# EAGLE design Keyboard V3.4 (EAGLE 9.3.1)
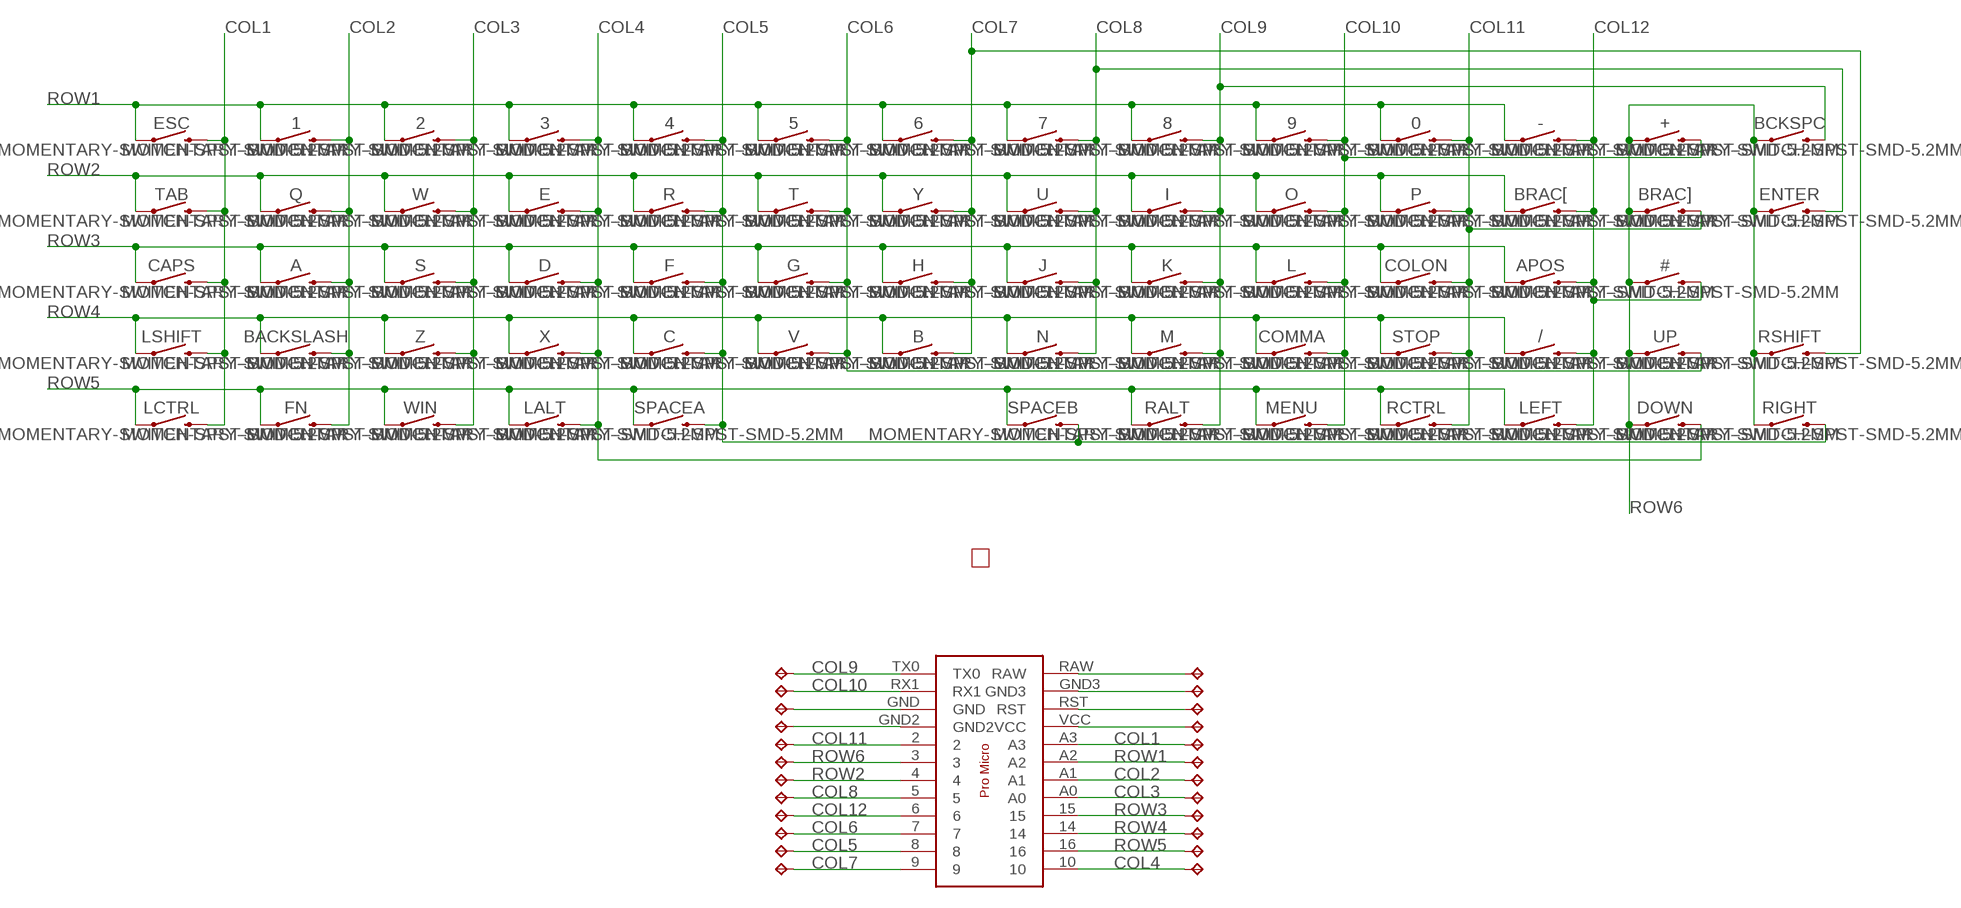
[diagram p0: schematic, sheet 1]

## Parts
0  MOMENTARY-SWITCH-SPST-SMD-5.2MM  [TACTILE_SWITCH_SMD_5.2MM]
1  MOMENTARY-SWITCH-SPST-SMD-5.2MM  [TACTILE_SWITCH_SMD_5.2MM]
2  MOMENTARY-SWITCH-SPST-SMD-5.2MM  [TACTILE_SWITCH_SMD_5.2MM]
3  MOMENTARY-SWITCH-SPST-SMD-5.2MM  [TACTILE_SWITCH_SMD_5.2MM]
4  MOMENTARY-SWITCH-SPST-SMD-5.2MM  [TACTILE_SWITCH_SMD_5.2MM]
5  MOMENTARY-SWITCH-SPST-SMD-5.2MM  [TACTILE_SWITCH_SMD_5.2MM]
6  MOMENTARY-SWITCH-SPST-SMD-5.2MM  [TACTILE_SWITCH_SMD_5.2MM]
7  MOMENTARY-SWITCH-SPST-SMD-5.2MM  [TACTILE_SWITCH_SMD_5.2MM]
8  MOMENTARY-SWITCH-SPST-SMD-5.2MM  [TACTILE_SWITCH_SMD_5.2MM]
9  MOMENTARY-SWITCH-SPST-SMD-5.2MM  [TACTILE_SWITCH_SMD_5.2MM]
#  MOMENTARY-SWITCH-SPST-SMD-5.2MM  [TACTILE_SWITCH_SMD_5.2MM]
+  MOMENTARY-SWITCH-SPST-SMD-5.2MM  [TACTILE_SWITCH_SMD_5.2MM]
-  MOMENTARY-SWITCH-SPST-SMD-5.2MM  [TACTILE_SWITCH_SMD_5.2MM]
/  MOMENTARY-SWITCH-SPST-SMD-5.2MM  [TACTILE_SWITCH_SMD_5.2MM]
A  MOMENTARY-SWITCH-SPST-SMD-5.2MM  [TACTILE_SWITCH_SMD_5.2MM]
APOS  MOMENTARY-SWITCH-SPST-SMD-5.2MM  [TACTILE_SWITCH_SMD_5.2MM]
B  MOMENTARY-SWITCH-SPST-SMD-5.2MM  [TACTILE_SWITCH_SMD_5.2MM]
BACKSLASH  MOMENTARY-SWITCH-SPST-SMD-5.2MM  [TACTILE_SWITCH_SMD_5.2MM]
BCKSPC  MOMENTARY-SWITCH-SPST-SMD-5.2MM  [TACTILE_SWITCH_SMD_5.2MM]
BRAC[  MOMENTARY-SWITCH-SPST-SMD-5.2MM  [TACTILE_SWITCH_SMD_5.2MM]
BRAC]  MOMENTARY-SWITCH-SPST-SMD-5.2MM  [TACTILE_SWITCH_SMD_5.2MM]
C  MOMENTARY-SWITCH-SPST-SMD-5.2MM  [TACTILE_SWITCH_SMD_5.2MM]
CAPS  MOMENTARY-SWITCH-SPST-SMD-5.2MM  [TACTILE_SWITCH_SMD_5.2MM]
COLON  MOMENTARY-SWITCH-SPST-SMD-5.2MM  [TACTILE_SWITCH_SMD_5.2MM]
COMMA  MOMENTARY-SWITCH-SPST-SMD-5.2MM  [TACTILE_SWITCH_SMD_5.2MM]
D  MOMENTARY-SWITCH-SPST-SMD-5.2MM  [TACTILE_SWITCH_SMD_5.2MM]
DOWN  MOMENTARY-SWITCH-SPST-SMD-5.2MM  [TACTILE_SWITCH_SMD_5.2MM]
E  MOMENTARY-SWITCH-SPST-SMD-5.2MM  [TACTILE_SWITCH_SMD_5.2MM]
ENTER  MOMENTARY-SWITCH-SPST-SMD-5.2MM  [TACTILE_SWITCH_SMD_5.2MM]
ESC  MOMENTARY-SWITCH-SPST-SMD-5.2MM  [TACTILE_SWITCH_SMD_5.2MM]
F  MOMENTARY-SWITCH-SPST-SMD-5.2MM  [TACTILE_SWITCH_SMD_5.2MM]
FN  MOMENTARY-SWITCH-SPST-SMD-5.2MM  [TACTILE_SWITCH_SMD_5.2MM]
G  MOMENTARY-SWITCH-SPST-SMD-5.2MM  [TACTILE_SWITCH_SMD_5.2MM]
H  MOMENTARY-SWITCH-SPST-SMD-5.2MM  [TACTILE_SWITCH_SMD_5.2MM]
I  MOMENTARY-SWITCH-SPST-SMD-5.2MM  [TACTILE_SWITCH_SMD_5.2MM]
J  MOMENTARY-SWITCH-SPST-SMD-5.2MM  [TACTILE_SWITCH_SMD_5.2MM]
K  MOMENTARY-SWITCH-SPST-SMD-5.2MM  [TACTILE_SWITCH_SMD_5.2MM]
L  MOMENTARY-SWITCH-SPST-SMD-5.2MM  [TACTILE_SWITCH_SMD_5.2MM]
LALT  MOMENTARY-SWITCH-SPST-SMD-5.2MM  [TACTILE_SWITCH_SMD_5.2MM]
LCTRL  MOMENTARY-SWITCH-SPST-SMD-5.2MM  [TACTILE_SWITCH_SMD_5.2MM]
LEFT  MOMENTARY-SWITCH-SPST-SMD-5.2MM  [TACTILE_SWITCH_SMD_5.2MM]
LSHIFT  MOMENTARY-SWITCH-SPST-SMD-5.2MM  [TACTILE_SWITCH_SMD_5.2MM]
M  MOMENTARY-SWITCH-SPST-SMD-5.2MM  [TACTILE_SWITCH_SMD_5.2MM]
MENU  MOMENTARY-SWITCH-SPST-SMD-5.2MM  [TACTILE_SWITCH_SMD_5.2MM]
N  MOMENTARY-SWITCH-SPST-SMD-5.2MM  [TACTILE_SWITCH_SMD_5.2MM]
O  MOMENTARY-SWITCH-SPST-SMD-5.2MM  [TACTILE_SWITCH_SMD_5.2MM]
P  MOMENTARY-SWITCH-SPST-SMD-5.2MM  [TACTILE_SWITCH_SMD_5.2MM]
Q  MOMENTARY-SWITCH-SPST-SMD-5.2MM  [TACTILE_SWITCH_SMD_5.2MM]
R  MOMENTARY-SWITCH-SPST-SMD-5.2MM  [TACTILE_SWITCH_SMD_5.2MM]
RALT  MOMENTARY-SWITCH-SPST-SMD-5.2MM  [TACTILE_SWITCH_SMD_5.2MM]
RCTRL  MOMENTARY-SWITCH-SPST-SMD-5.2MM  [TACTILE_SWITCH_SMD_5.2MM]
RIGHT  MOMENTARY-SWITCH-SPST-SMD-5.2MM  [TACTILE_SWITCH_SMD_5.2MM]
RSHIFT  MOMENTARY-SWITCH-SPST-SMD-5.2MM  [TACTILE_SWITCH_SMD_5.2MM]
S  MOMENTARY-SWITCH-SPST-SMD-5.2MM  [TACTILE_SWITCH_SMD_5.2MM]
SPACEA  MOMENTARY-SWITCH-SPST-SMD-5.2MM  [TACTILE_SWITCH_SMD_5.2MM]
SPACEB  MOMENTARY-SWITCH-SPST-SMD-5.2MM  [TACTILE_SWITCH_SMD_5.2MM]
STOP  MOMENTARY-SWITCH-SPST-SMD-5.2MM  [TACTILE_SWITCH_SMD_5.2MM]
T  MOMENTARY-SWITCH-SPST-SMD-5.2MM  [TACTILE_SWITCH_SMD_5.2MM]
TAB  MOMENTARY-SWITCH-SPST-SMD-5.2MM  [TACTILE_SWITCH_SMD_5.2MM]
TP1  TPTP14R  [TP14R]
TP2  TPTP14R  [TP14R]
TP3  TPTP14R  [TP14R]
TP4  TPTP14R  [TP14R]
TP5  TPTP14R  [TP14R]
TP6  TPTP14R  [TP14R]
TP7  TPTP14R  [TP14R]
TP8  TPTP14R  [TP14R]
TP9  TPTP14R  [TP14R]
TP10  TPTP14R  [TP14R]
TP11  TPTP14R  [TP14R]
TP12  TPTP14R  [TP14R]
TP13  TPTP14R  [TP14R]
TP14  TPTP14R  [TP14R]
TP15  TPTP14R  [TP14R]
TP16  TPTP14R  [TP14R]
TP17  TPTP14R  [TP14R]
TP18  TPTP14R  [TP14R]
TP19  TPTP14R  [TP14R]
TP20  TPTP14R  [TP14R]
TP21  TPTP14R  [TP14R]
TP22  TPTP14R  [TP14R]
TP23  TPTP14R  [TP14R]
TP24  TPTP14R  [TP14R]
U  MOMENTARY-SWITCH-SPST-SMD-5.2MM  [TACTILE_SWITCH_SMD_5.2MM]
U$1  PEANUT-PRO-MICRO  [PRO-MICRO]
U$3  AMP-HALF  [AMP-HALF]
UP  MOMENTARY-SWITCH-SPST-SMD-5.2MM  [TACTILE_SWITCH_SMD_5.2MM]
V  MOMENTARY-SWITCH-SPST-SMD-5.2MM  [TACTILE_SWITCH_SMD_5.2MM]
W  MOMENTARY-SWITCH-SPST-SMD-5.2MM  [TACTILE_SWITCH_SMD_5.2MM]
WIN  MOMENTARY-SWITCH-SPST-SMD-5.2MM  [TACTILE_SWITCH_SMD_5.2MM]
X  MOMENTARY-SWITCH-SPST-SMD-5.2MM  [TACTILE_SWITCH_SMD_5.2MM]
Y  MOMENTARY-SWITCH-SPST-SMD-5.2MM  [TACTILE_SWITCH_SMD_5.2MM]
Z  MOMENTARY-SWITCH-SPST-SMD-5.2MM  [TACTILE_SWITCH_SMD_5.2MM]

## Nets
COL1: CAPS.3 CAPS.4 ESC.3 ESC.4 LCTRL.3 LCTRL.4 LSHIFT.3 LSHIFT.4 TAB.3 TAB.4 TP8.TP U$1.A3
COL2: 1.3 1.4 A.3 A.4 BACKSLASH.3 BACKSLASH.4 FN.3 FN.4 Q.3 Q.4 TP6.TP U$1.A1
COL3: 2.3 2.4 S.3 S.4 TP5.TP U$1.A0 W.3 W.4 WIN.3 WIN.4 Z.3 Z.4
COL4: 3.3 3.4 D.3 D.4 DOWN.3 DOWN.4 E.3 E.4 LALT.3 LALT.4 TP2.TP U$1.10 X.3 X.4
COL5: 4.3 4.4 C.3 C.4 F.3 F.4 R.3 R.4 RIGHT.3 RIGHT.4 SPACEA.3 SPACEA.4 SPACEB.3 SPACEB.4 TP17.TP U$1.8
COL6: 5.3 5.4 G.3 G.4 T.3 T.4 TP16.TP U$1.7 UP.3 UP.4 V.3 V.4
COL7: 6.3 6.4 B.3 B.4 H.3 H.4 RSHIFT.3 RSHIFT.4 TP18.TP U$1.9 Y.3 Y.4
COL8: 7.3 7.4 ENTER.3 ENTER.4 J.3 J.4 N.3 N.4 TP14.TP U$1.5 U.3 U.4
COL9: 8.3 8.4 BCKSPC.3 BCKSPC.4 I.3 I.4 K.3 K.4 M.3 M.4 RALT.3 RALT.4 TP9.TP U$1.TX0
COL10: 9.3 9.4 +.3 +.4 COMMA.3 COMMA.4 L.3 L.4 MENU.3 MENU.4 O.3 O.4 TP10.TP U$1.RX1
COL11: 0.3 0.4 BRAC].3 BRAC].4 COLON.3 COLON.4 P.3 P.4 RCTRL.3 RCTRL.4 STOP.3 STOP.4 TP11.TP U$1.2
COL12: #.3 #.4 -.3 -.4 /.3 /.4 APOS.3 APOS.4 BRAC[.3 BRAC[.4 LEFT.3 LEFT.4 TP15.TP U$1.6
N$1: TP20.TP U$1.GND
N$2: TP19.TP U$1.GND2
N$3: TP24.TP U$1.RAW
N$4: TP23.TP U$1.GND3
N$5: TP22.TP U$1.RST
N$6: TP21.TP U$1.VCC
ROW1: 0.1 0.2 1.1 1.2 2.1 2.2 3.1 3.2 4.1 4.2 5.1 5.2 6.1 6.2 7.1 7.2 8.1 8.2 9.1 9.2 -.1 -.2 ESC.1 ESC.2 TP7.TP U$1.A2
ROW2: BRAC[.1 BRAC[.2 E.1 E.2 I.1 I.2 O.1 O.2 P.1 P.2 Q.1 Q.2 R.1 R.2 T.1 T.2 TAB.1 TAB.2 TP13.TP U$1.4 U.1 U.2 W.1 W.2 Y.1 Y.2
ROW3: A.1 A.2 APOS.1 APOS.2 CAPS.1 CAPS.2 COLON.1 COLON.2 D.1 D.2 F.1 F.2 G.1 G.2 H.1 H.2 J.1 J.2 K.1 K.2 L.1 L.2 S.1 S.2 TP4.TP U$1.15
ROW4: /.1 /.2 B.1 B.2 BACKSLASH.1 BACKSLASH.2 C.1 C.2 COMMA.1 COMMA.2 LSHIFT.1 LSHIFT.2 M.1 M.2 N.1 N.2 STOP.1 STOP.2 TP3.TP U$1.14 V.1 V.2 X.1 X.2 Z.1 Z.2
ROW5: FN.1 FN.2 LALT.1 LALT.2 LCTRL.1 LCTRL.2 LEFT.1 LEFT.2 MENU.1 MENU.2 RALT.1 RALT.2 RCTRL.1 RCTRL.2 SPACEA.1 SPACEA.2 SPACEB.1 SPACEB.2 TP1.TP U$1.16 WIN.1 WIN.2
ROW6: #.1 #.2 +.1 +.2 BCKSPC.1 BCKSPC.2 BRAC].1 BRAC].2 DOWN.1 DOWN.2 ENTER.1 ENTER.2 RIGHT.1 RIGHT.2 RSHIFT.1 RSHIFT.2 TP12.TP U$1.3 UP.1 UP.2

## Library data of the parts
0 1-9 # + - / A APOS B BACKSLASH BCKSPC BRAC[ BRAC] C CAPS COLON COMMA D DOWN E ENTER ESC F FN G H I J K L LALT LCTRL LEFT LSHIFT M MENU N O P Q R RALT RCTRL RIGHT RSHIFT S SPACEA SPACEB STOP T TAB U UP V W WIN X Y Z = SparkFun-Switches-Edit:MOMENTARY-SWITCH-SPST: Momentary Switch (Pushbutton) - SPST Normally-open (NO) SPST momentary switches (buttons, pushbuttons). Variants PTH-12MM - 12mm square, through-hole Momentary Pushbutton Switch - 12mm Square <https://www.sparkfun.com/products/9190> (COM-09190) PTH-6.0MM, PTH-6.0MM-KIT - 6.0mm square, through-hole Mini Pushbutton Switch <https://www.sparkfun.com/products/97> (COM-00097) KIT package intended for soldering kit's - only one side of pads' copper is exposed. PTH-RIGHT-ANGLE-KIT - Right-angle, through-hole Right Angle Tactile Button <https://www.sparkfun.com/products/10791> - Used on SparkFun BigTime Watch Kit <https://www.sparkfun.com/products/11734> SMD-12MM - 12mm square, surface-mount Tactile Button - SMD (12mm) <https://www.sparkfun.com/products/12993> (COM-12993) Used on SparkFun PicoBoard <https://www.sparkfun.com/products/11888> SMD-4.5MM - 4.5mm Square Trackball Switch Used on SparkFun Blackberry Trackballer Breakout <https://www.sparkfun.com/products/13169> SMD-4.6MMX2.8MM - 4.60mm x 2.80mm, surface mount Used on SparkFun SAMD21 Mini Breakout <https://www.sparkfun.com/products/13664> SMD-5.2MM, SMD-5.2-REDUNDANT - 5.2mm square, surface-mount Mini Pushbutton Switch - SMD <https://www.sparkfun.com/products/8720> (COM-08720) Used on Arduino Pro Mini <https://www.sparkfun.com/products/11114> REDUNDANT package connects both switch circuits together SMD-6.0X3.5MM - 6.0 x 3.5mm, surface mount Momentary Reset Switch SMD <https://www.sparkfun.com/products/8229> (COM-08229) SMD-6.2MM-TALL - 6.2mm square, surface mount Tactile Button - SMD (6mm) <https://www.sparkfun.com/products/12992> Used on SparkFun Digital Sandbox <https://www.sparkfun.com/products/12651> SMD-RIGHT-ANGLE - Right-angle, surface mount Used on SparkFun Block for Intel® Edison - Arduino <https://www.sparkfun.com/products/13036>; PROD_ID: SWCH-08247; SF_SKU: COM-08720
TP1-TP24 = testpad:TP: Test pad
U$1 = peanut:PEANUT-PRO-MICRO
U$3 = peanut:AMP-HALF

## Board
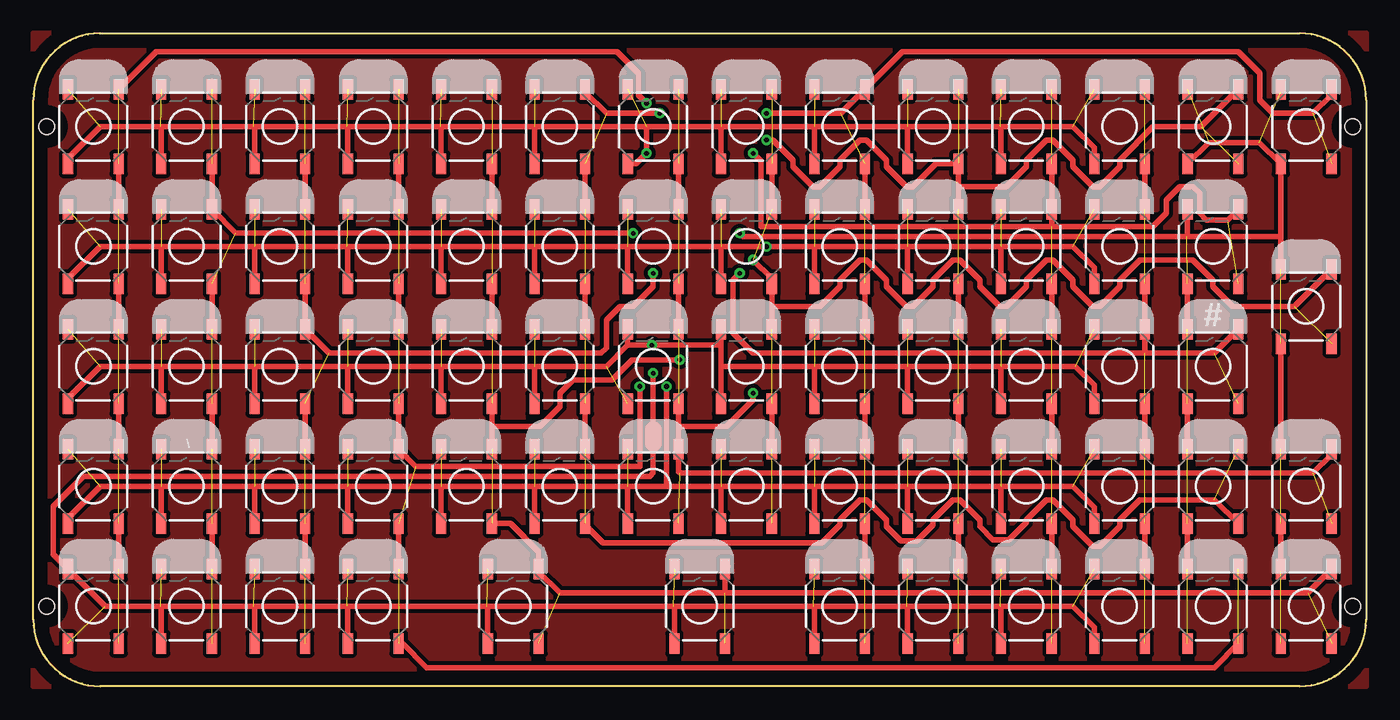
[diagram p1: board, top side]
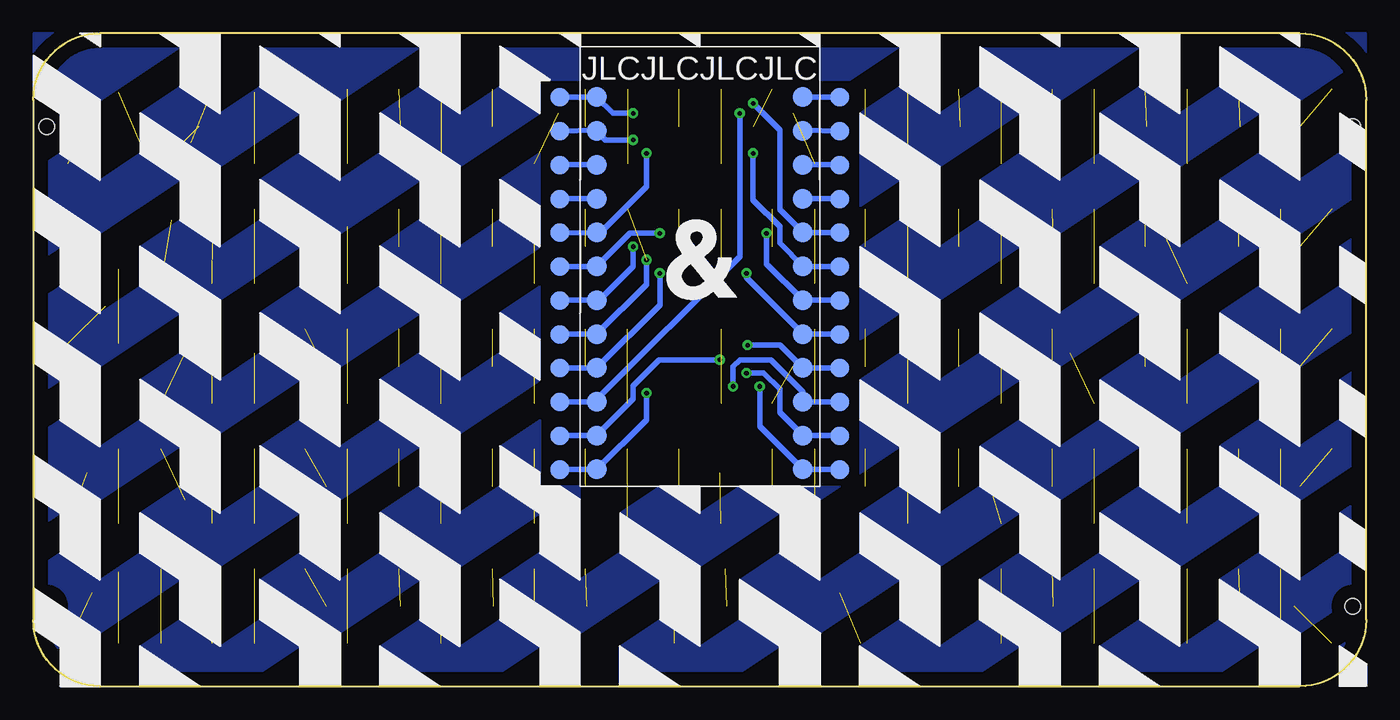
[diagram p2: board, bottom side, seen from below]

Size 100 x 49 mm. Coordinates in mm from the lower left corner, seen from the top.
Outline: 0,5 0,44 arc-90 5,49 95,49 arc-90 100,44 100,5 arc-90 95,0 5,0 arc-90 0,5
Copper layers (1*16): Top 0.035mm / dielectric 1.5mm / Bottom 0.035mm
Design rules "default": minimum track width 6mil, minimum drill 0.35mm, track to track 6mil, track to pad 6mil, pad to pad 6mil, via to via 6mil, smd to smd 6mil, copper to edge 40mil, drill to drill 6mil, minimum pad ring 10mil, minimum via ring 8mil, stop-mask expansion 4mil, vias tented up to drill 0mil, thermal gap 10mil
Holes 1.15 mm at 99,42 1,6 1,42 99,6

### Footprints (pad centres in the part's own frame; a part is rotated, then mirrored left to right if it is on the bottom)
TACTILE_SWITCH_SMD_5.2MM = smd 1.524 x 0.762: 1 -2.794,1.905; 2 2.794,1.905; 3 -2.794,-1.905; 4 2.794,-1.905
TP14R = smd 1.4 x 1.4: TP 0,0
PRO-MICRO = smd 1.5 x 1.5: 2 19.05,16.73; 3 16.51,16.73; 4 13.97,16.73; 5 11.43,16.73; 6 8.89,16.73; 7 6.35,16.73; 8 3.81,16.73; 9 1.27,16.73; 10 1.27,1.27; 14 6.35,1.27; 15 8.89,1.27; 16 3.81,1.27; A0 11.43,1.27; A1 13.97,1.27; A2 16.51,1.27; A3 19.05,1.27; GND 24.13,16.73; GND2 21.59,16.73; GND3 26.67,1.27; RAW 29.21,1.27; RST 24.13,1.27; RX1 26.67,16.73; TX0 29.21,16.73; VCC 21.59,1.27

### Placement (x,y rotation side)
0  74.5,42 90 top
1  11.5,42 90 top
2  18.5,42 90 top
3  25.5,42 90 top
4  32.5,42 90 top
5  39.5,42 90 top
6  46.5,42 90 top
7  53.5,42 90 top
8  60.5,42 90 top
9  67.5,42 90 top
#  88.5,24 90 top
+  88.5,42 90 top
-  81.5,42 90 top
/  81.5,15 90 top
A  11.5,24 90 top
APOS  81.5,24 90 top
B  46.5,15 90 top
BACKSLASH  11.5,15 90 top
BCKSPC  95.5,42 90 top
BRAC[  81.5,33 90 top
BRAC]  88.5,33 90 top
C  32.5,15 90 top
CAPS  4.5,24 90 top
COLON  74.5,24 90 top
COMMA  67.5,15 90 top
D  25.5,24 90 top
DOWN  88.5,6 90 top
E  25.5,33 90 top
ENTER  95.5,28.5 90 top
ESC  4.5,42 90 top
F  32.5,24 90 top
FN  11.5,6 90 top
G  39.5,24 90 top
H  46.5,24 90 top
I  60.5,33 90 top
J  53.5,24 90 top
K  60.5,24 90 top
L  67.5,24 90 top
LALT  25.5,6 90 top
LCTRL  4.5,6 90 top
LEFT  81.5,6 90 top
LSHIFT  4.5,15 90 top
M  60.5,15 90 top
MENU  67.5,6 90 top
N  53.5,15 90 top
O  67.5,33 90 top
P  74.5,33 90 top
Q  11.5,33 90 top
R  32.5,33 90 top
RALT  60.5,6 90 top
RCTRL  74.5,6 90 top
RIGHT  95.5,6 90 top
RSHIFT  95.5,15 90 top
S  18.5,24 90 top
SPACEA  36,6 90 top
SPACEB  50,6 90 top
STOP  74.5,15 90 top
T  39.5,33 90 top
TAB  4.5,33 90 top
TP1  39.5,18.79 0 bottom
TP2  39.5,16.25 0 bottom
TP3  39.5,21.33 0 bottom
TP4  39.5,23.87 0 bottom
TP5  39.5,26.41 0 bottom
TP6  39.5,28.95 0 bottom
TP7  39.5,31.49 0 bottom
TP8  39.5,34.03 0 bottom
TP9  60.5,44.19 0 bottom
TP10  60.5,41.65 0 bottom
TP11  60.5,34.03 0 bottom
TP12  60.5,31.49 0 bottom
TP13  60.5,28.95 0 bottom
TP14  60.5,26.41 0 bottom
TP15  60.5,23.87 0 bottom
TP16  60.5,21.33 0 bottom
TP17  60.5,18.79 0 bottom
TP18  60.5,16.25 0 bottom
TP19  60.5,36.57 0 bottom
TP20  60.5,39.11 0 bottom
TP21  39.5,36.57 0 bottom
TP22  39.5,39.11 0 bottom
TP23  39.5,41.65 0 bottom
TP24  39.5,44.19 0 bottom
U  53.5,33 90 top
U$1  41,15 90 bottom
U$3  52.5,29 0 bottom
UP  88.5,15 90 top
V  39.5,15 90 top
W  18.5,33 90 top
WIN  18.5,6 90 top
X  25.5,15 90 top
Y  46.5,33 90 top
Z  18.5,15 90 top

### Tracks (layer width: path | path; a pad name or v marks a point on that pad's centre or on a via)
COL1  (via drill 0.35)  (5 unrouted)
  Top 0.406: LCTRL.4 LSHIFT.3 | LSHIFT.4 CAPS.3 | CAPS.4 TAB.3 | TAB.4 ESC.3 | v46,43.75 45.4,44.35 45.4,46 43.8,47.6 9.21,47.6 ESC.4
  Bottom 0.406: U$1.A3 42.22,34 | U$1.A3 39.55,34.05 TP8.TP | U$1.A3 44,35.78 44,41.75 v46,43.75
COL2  (via drill 0.35)  (5 unrouted)
  Top 0.406: 1.3 Q.4 15.2,34 v45,34 | Q.3 A.4 | A.3 BACKSLASH.4 | BACKSLASH.3 FN.4 | 13.4,45.41 1.4
  Bottom 0.406: v45,34 45,31.7 U$1.A1 39.53,28.97 TP6.TP
COL3  (via drill 0.35)  (5 unrouted)
  Top 0.406: WIN.4 Z.3 | Z.4 S.3 | W.3 S.4 22.2,25 42.6,25 43,25.4 43,27.5 44,28.5 45,28.5 46.5,30 v46.5,31 | W.4 2.3
  Bottom 0.406: 42.57,26.43 U$1.A0 | v46.5,31 46.5,30.66 U$1.A0 | U$1.A0 39.57,26.43 TP5.TP
COL4  (via drill 0.35)  (6 unrouted)
  Top 0.406: 3.3 E.4 | E.3 D.4 | D.3 X.4 28.7,16.5 45.5,16.5 v45.5,22.5 | X.3 LALT.4 | LALT.3 27.69,3.21 29.5,1.4 88.6,1.4 DOWN.3
  Bottom 0.406: v45.5,22.5 45.5,19.5 U$1.10 39.52,16.27 TP2.TP
COL5  (via drill 0.35)  (7 unrouted)
  Top 0.406: C.4 34.41,19.5 | 34.41,19.5 F.3 | F.4 R.3 | R.4 4.3 | 51.91,7 SPACEB.4 52.11,9 | 34.41,19.5 38,19.5 39.5,21 39.5,22 40.5,23 43.4,23 44.9,24.5 v48.5,24.5 | 51.91,7 95.61,7 RIGHT.4 | 51.91,7 39.5,7 37.91,8.6 SPACEA.4 37.91,10.1 35.79,12.21 C.3
  Bottom 0.406: v48.5,24.5 53.04,24.5 55,22.54 55,21.54 U$1.8 60.44,18.81 TP17.TP
COL6  (via drill 0.35)  (5 unrouted)
  Top 0.406: V.4 G.3 | G.4 T.3 | T.4 5.3 | V.3 41.41,12.1 42.75,10.75 59.15,10.75 60.5,12.1 60.5,12.5 62,14 62.5,14 64,12.5 64,12 65.1,10.9 66.3,10.9 67.5,12.1 67.5,12.5 69,14 69.5,14 71,12.5 71,12 72,11 73.2,11 74.5,12.3 74.5,12.5 76,14 76.5,14 78,12.5 78,12 79.5,10.5 80,10.5 81.5,12 81.5,12.5 83,14 88.61,14 UP.3 | UP.4 90.41,18.09 | 5.4 41.41,44.59 43,43 v47,43
  Bottom 0.406: v47,43 47,32.25 57.73,21.52 U$1.7 60.35,21.35 TP16.TP
COL7  (via drill 0.35)  (5 unrouted)
  Top 0.406: 6.3 Y.4 | Y.3 H.4 | H.3 48.41,19.5 | 48.41,19.5 B.4 48.41,16.09 48.5,16 96,16 97.41,17.41 RSHIFT.4 | 48.5,44.89 6.4 | v54,22 54,21.5 52,19.5 48.41,19.5
  Bottom 0.406: v54,22 54,20 U$1.9 60.48,16.27 TP18.TP
COL8  (via drill 0.35)  (5 unrouted)
  Top 0.406: N.4 J.3 | J.4 55.41,28.5 | U.4 7.3 | ENTER.4 94.61,28.5 90,28.5 88.5,30 88.5,30.5 87,32 83,32 81.5,30.5 81.5,30 80,28.5 79.5,28.5 78,30 78,30.5 76.5,32 76,32 74.5,30.5 74.5,30 73,28.5 72.5,28.5 71,30 71,30.5 69.5,32 69,32 67.5,30.5 67.5,30 66,28.5 65.5,28.5 64,30 64,30.5 62.5,32 62,32 60.5,30.5 60.5,30 59,28.5 55.41,28.5 | 55.41,28.5 U.3 55.41,30.59 v54,32
  Bottom 0.406: v54,32 54,30.16 U$1.5 60.43,26.43 TP14.TP
COL9  (via drill 0.35)  (6 unrouted)
  Top 0.406: RALT.4 M.3 | 8.3 I.4 | I.3 K.4 | K.3 M.4 | BCKSPC.4 97.41,44.41 96,43 93,43 92,44 92,46 90.4,47.6 65.21,47.6 8.4 60.61,43 v55,43
  Bottom 0.406: 57.71,44.21 U$1.TX0 | U$1.TX0 60.46,44.21 TP9.TP | U$1.TX0 56.52,43 v55,43
COL10  (via drill 0.35)  (6 unrouted)
  Top 0.406: MENU.4 COMMA.3 | COMMA.4 L.3 | L.4 O.3 | O.4 69.41,37.5 | 69.41,37.5 9.3 67.71,39.21 66,37.5 65.5,37.5 64,39 64,39.5 62.5,41 62,41 60.5,39.5 60.5,39 59,37.5 58.5,37.5 57,39 57,39.5 55.5,41 v55,41 | +.4 87.61,42 84,42 81.5,39.5 81.5,39 80,37.5 79.5,37.5 78,39 78,39.5 76.5,41 76,41 74.5,39.5 74.5,39 73,37.5 69.41,37.5
  Bottom 0.406: v55,41 57.06,41 U$1.RX1 57.81,41.75 TP10.TP
COL11  (via drill 0.35)  (6 unrouted)
  Top 0.406: RCTRL.4 STOP.3 | STOP.4 COLON.3 | COLON.4 P.3 | 0.3 P.4 76.41,34.5 | 76.41,34.5 84,34.5 85,35.5 85,36.5 86,37.5 87,37.5 87.5,37 87.5,35.5 88,35 89.61,35 BRAC].4 | v54,40 54.6,39.4 54.6,34.5 76.41,34.5
  Bottom 0.406: v54,40 54,37.5 57.45,34.05 U$1.2 57.78,34 TP11.TP
COL12  (via drill 0.35)  (6 unrouted)
  Top 0.406: LEFT.4 /.3 | /.4 APOS.3 | BRAC[.3 APOS.4 83.41,25 | BRAC[.4 -.3 | 83.41,44.59 -.4 | #.4 88.61,25 83.41,25 | v53,31 52.5,30.5 52.5,26.5 54,25 83.41,25
  Bottom 0.406: v53,31 53,28.62 U$1.6 60.39,23.89 TP15.TP
GND
  pour Top (isolate 0.305): 0,49 100,49 100,0 0,0
  pour Bottom: 11,25 8,23 14,19 20,23 17,25 14,23
  pour Bottom: 20,43 17,45 14,43 11,45 8,43 14,39
  pour Bottom: 2,43 0,44.33 0,41.67
  pour Bottom: 0,31.67 0,34.33 2,33
  pour Bottom: 0,24.33 2,23 0,21.67
  pour Bottom: 0,14.33 2,13 0,11.67
  pour Bottom: 0,4.33 2,3 0,1.67
  pour Bottom: 26,40 23,38 20,40 17,38 23,34 29,38
  pour Bottom: 26,20 23,18 20,20 17,18 23,14 29,18
  pour Bottom: 23,8 20,10 17,8 23,4 29,8 26,10
  pour Bottom: 26,13 29,15 32,13 35,15 38,13 32,9
  pour Bottom: 32,19 38,23 35,25 32,23 29,25 26,23
  pour Bottom: 32,29 38,33 35,35 32,33 29,35 26,33
  pour Bottom: 32,39 38,43 35,45 32,43 29,45 26,43
  pour Bottom: 38,40 38,36 35,38
  pour Bottom: 38,30 38,26 35,28
  pour Bottom: 35,8 38,10 41,8 44,10 47,8 41,4
  pour Bottom: 53,15 50,13 47,15 44,13 50,9 56,13
  pour Bottom: 56,10 59,8 62,10 65,8 59,4 53,8
  pour Bottom: 68,13 71,15 74,13 68,9 62,13 65,15
  pour Bottom: 68,23 71,25 74,23 68,19 62,23 65,25
  pour Bottom: 68,33 71,35 74,33 68,29 62,33 65,35
  pour Bottom: 68,39 74,43 71,45 68,43 65,45 62,43
  pour Bottom: 62,40 65,38 62,36
  pour Bottom: 62,30 65,28 62,26
  pour Bottom: 74,10 71,8 77,4 83,8 80,10 77,8
  pour Bottom: 86,9 92,13 89,15 86,13 83,15 80,13
  pour Bottom: 86,19 92,23 89,25 86,23 83,25 80,23
  pour Bottom: 86,29 92,33 89,35 86,33 83,35 80,33
  pour Bottom: 80,43 86,39 92,43 89,45 86,43 83,45
  pour Bottom: 80,40 83,38 77,34 71,38 74,40 77,38
  pour Bottom: 80,30 83,28 77,24 71,28 74,30 77,28
  pour Bottom: 83,18 80,20 77,18 74,20 71,18 77,14
  pour Bottom: 100,41.67 100,44.33 98,43
  pour Bottom: 100,34.33 100,31.67 98,33
  pour Bottom: 100,24.33 100,21.67 98,23
  pour Bottom: 100,14.33 100,11.67 98,13
  pour Bottom: 100,4.33 100,1.67 98,3
  pour Bottom: 62,16 65,18 62,20
  pour Bottom: 38,20 38,16 35,18
  pour Bottom: 41,14 42.5,15 39.5,15
  pour Bottom: 59,14 59,15 60.5,15
  pour Bottom: 95,44 89,48 90.5,49 93.5,49 95,48 96.5,49 100,49 100,47.5
  pour Bottom: 83,48 77,44 71,48 72.5,49 75.5,49 77,48 78.5,49 81.5,49
  pour Bottom: 60.5,49 59,48 59,45.5 61.25,45.5 65,48 63.5,49
  pour Bottom: 41,45.5 41,48 39.5,49 36.5,49 35,48 38.75,45.5
  pour Bottom: 29,48 23,44 17,48 18.5,49 21.5,49 23,48 24.5,49 27.5,49
  pour Bottom: 11,48 5,44 5,48 6.5,49 9.5,49
  pour Bottom: 5,48 5,44 2,46 0,47.33 0,49 3.5,49
  pour Bottom: 98,40 95,38 92,40 89,38 95,34 100,37.33 100,38.67
  pour Bottom: 98,30 95,28 92,30 89,28 95,24 100,27.33 100,28.67
  pour Bottom: 98,10 95,8 92,10 89,8 95,4 100,7.33 100,8.67
  pour Bottom: 98,20 95,18 92,20 89,18 95,14 100,17.33 100,18.67
  pour Bottom: 5,38 8,40 11,38 5,34 0,37.33 0,38.67 2,40
  pour Bottom: 5,28 8,30 11,28 5,24 0,27.33 0,28.67 2,30
  pour Bottom: 5,18 8,20 11,18 5,14 0,17.33 0,18.67 2,20
  pour Bottom: 5,8 8,10 11,8 5,4 0,7.33 0,8.67 2,10
  pour Bottom: 15.5,0 20,3 17,5 14,3 11,5 8,3 12.5,0
  pour Bottom: 33.5,0 38,3 35,5 32,3 29,5 26,3 30.5,0
  pour Bottom: 51.5,0 56,3 53,5 50,3 47,5 44,3 48.5,0
  pour Bottom: 69.5,0 74,3 71,5 68,3 65,5 62,3 66.5,0
  pour Bottom: 87.5,0 92,3 89,5 86,3 83,5 80,3 84.5,0
GND1
  pour Bottom: 20,30 17,28 23,24 29,28 26,30 23,28
GND2
  pour Bottom: 11,35 8,33 14,29 20,33 17,35 14,33
GND3
  pour Bottom: 11,15 8,13 14,9 20,13 17,15 14,13
N$1
  Bottom 0.406: TP20.TP 60.37,39.13 U$1.GND
N$2
  Bottom 0.406: TP19.TP 60.41,36.59 U$1.GND2
N$3
  Bottom 0.406: U$1.RAW 39.54,44.21 TP24.TP
N$4
  Bottom 0.406: U$1.GND3 42.19,41.75 TP23.TP
N$5
  Bottom 0.406: U$1.RST 39.63,39.13 TP22.TP
N$6
  Bottom 0.406: U$1.VCC 39.59,36.59 TP21.TP
ROW1  (via drill 0.35)  (12 unrouted)
  Top 0.406: ESC.1 2.6,39.59 5,42 9.5,42 | 9.5,42 16.5,42 | 16.5,42 23.5,42 | 23.5,42 30.5,42 | 30.5,42 37.59,42 | 46,42 51.59,42 | 1.1 9.6,41.91 9.5,42 | 2.1 16.59,41.91 16.5,42 | 3.1 23.59,41.91 23.5,42 | 4.1 30.59,41.91 30.5,42 | 5.1 37.59,42 | 7.1 51.59,42 | 8.1 58.59,42 | 65.59,42 9.1 | 0.1 72.59,41.91 72.5,42 | 46,42 v46,40 45.21,39.21 6.1 | -.1 79.59,40.41 78,42 72.5,42 | 58.59,42 65.59,42 | 51.59,42 58.59,42 | 65.59,42 72.5,42 | 37.59,42 46,42
  Bottom 0.406: v46,40 46,36.5 44,34.5 44,33.24 U$1.A2 39.51,31.51 TP7.TP
ROW2  (via drill 0.35)  (12 unrouted)
  Top 0.406: TAB.1 2.6,30.59 5,33 9.6,33 | 23.5,33 30.59,33 | 58.59,33 v55,33 51.59,33 | Q.1 9.6,33 | 16.59,33 W.1 | E.1 23.59,32.91 23.5,33 | R.1 30.59,33 | 37.59,33 T.1 | 44.59,33 Y.1 | 51.59,33 U.1 | I.1 58.59,33 | 65.59,33 O.1 | 72.59,33 P.1 | BRAC[.1 79.59,31.41 78,33 72.59,33 | 9.6,33 16.59,33 | 16.59,33 23.5,33 | 30.59,33 37.59,33 | 37.59,33 44.59,33 | 44.59,33 51.59,33 | 58.59,33 65.59,33 | 65.59,33 72.59,33
  Bottom 0.406: v55,33 55,31.5 57.53,28.97 U$1.4 60.47,28.97 TP13.TP
ROW3  (via drill 0.35)  (11 unrouted)
  Top 0.406: CAPS.1 2.6,21.59 5,24 9.6,24 | A.1 9.6,24 | 16.59,24 S.1 | 23.59,24 D.1 | 30.59,24 F.1 | 37.59,24 G.1 | K.1 58.59,24 | 65.59,24 L.1 | 72.59,24 COLON.1 | APOS.1 79.59,22.59 78.19,24 72.59,24 | 58.59,24 65.59,24 | 65.59,24 72.59,24 | J.2 51.59,25.5 | 51.59,25.5 51.59,24 | 51.59,24 J.1 | 58.59,24 51.59,24 | 9.6,24 16.59,24 | 16.59,24 23.59,24 | 23.59,24 30.59,24 | 30.59,24 37.59,24 | 37.59,24 43,24 44.59,25.59 | 44.59,25.59 H.2 | 51.59,25.5 51.5,25.59 v46.41,25.59 44.59,25.59
  Bottom 0.406: v46.41,25.59 43.98,25.59 U$1.15 39.61,23.89 TP4.TP
ROW4  (via drill 0.35)  (12 unrouted)
  Top 0.406: LSHIFT.1 2.6,12.6 5,15 9.6,15 | 47.5,15 51.59,15 | BACKSLASH.1 9.6,15 | 16.59,15 Z.1 | 23.59,15 X.1 | 30.59,15 C.1 | 37.59,15 V.1 | 44.59,15 B.1 | N.1 51.59,15 | 58.59,15 M.1 | 65.59,15 COMMA.1 | 72.59,15 STOP.1 | v47.5,22.5 47.5,15 | 51.59,15 58.59,15 | 58.59,15 65.59,15 | 65.59,15 72.59,15 | 72.59,15 78,15 79.59,13.4 /.1 | 9.6,15 16.59,15 | 16.59,15 23.59,15 | 23.59,15 30.59,15 | 30.59,15 37.59,15 | 37.59,15 44.59,15 | 44.59,15 47.5,15
  Bottom 0.406: v47.5,22.5 47.5,24 47,24.5 44.67,24.5 42.27,22.1 U$1.14 39.65,21.35 TP3.TP
ROW5  (via drill 0.35)  (10 unrouted)
  Top 0.406: 9.5,6 16.5,6 | 16.5,6 23.5,6 | 23.5,6 34,6 | 34,6 48,6 | 48,6 58.5,6 | 58.5,6 65.5,6 | 65.5,6 72.5,6 | FN.1 9.6,5.91 9.5,6 | WIN.1 16.59,5.91 16.5,6 | LALT.1 23.59,5.91 23.5,6 | RALT.1 58.59,5.91 58.5,6 | MENU.1 65.59,5.91 65.5,6 | RCTRL.1 72.59,5.91 72.5,6 | LEFT.1 79.59,4.41 78,6 72.5,6 | SPACEA.1 34.09,5.91 34,6 | SPACEB.1 48.09,5.91 48,6 | v46.5,23.5 46.5,19.25 | 46.5,18.25 46.5,16 46.25,15.75 3.75,15.75 1.5,13.5 1.5,9.89 LCTRL.2 5.39,6 9.5,6
  Top 1.27: 46.5,19.25 46.5,18.25
  Bottom 0.406: TP1.TP 39.56,18.81 U$1.16 44,20.54 44,22.29 45.21,23.5 v46.5,23.5
ROW6  (via drill 0.35)  (9 unrouted)
  Top 0.406: 93.59,44.59 BCKSPC.2 | #.2 BRAC].1 | 93.59,33.75 ENTER.2 | ENTER.1 RSHIFT.2 | RSHIFT.1 RIGHT.2 93.59,8.6 | +.1 88.19,40.81 92,40.81 BCKSPC.1 93.59,33.75 | BRAC].2 86.59,33.79 86.55,33.75 | v53,34 53.25,33.75 86.55,33.75 | 93.59,33.75 86.55,33.75 | UP.1 DOWN.2 | #.1 UP.2
  Bottom 0.406: v53,34 v53.01,34.01 55.23,34.01 U$1.3 TP12.TP

### Text on the board
tPlace: # | /
bPlace: JLCJLCJLCJLC
tStop: ` ¦ | 1 | 2 | 3 | 4 | 5 | 6 | 7 | 8 | 9 | 0 | - | = | Tab | Q | W | E | R | T | Y | U | I | O | P | [ | ] | Cap | A | S | D | F | G | H | J | K | L | ; | ' | # | Z | X | C | V | B | N | M | , | . | ] | ] | Ctrl | Fn | Alt | Alt | Ctrl